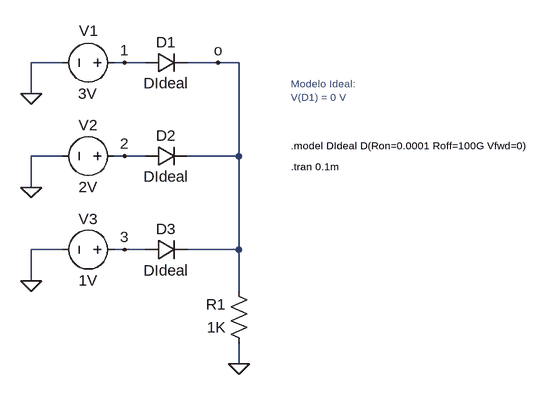
[diagram p0: schematic taller2_ejercicio1e.asc]
taller2_ejercicio1e.asc, the LTspice schematic file:
Version 4
SHEET 1 1376 680
WIRE -208 32 -256 32
WIRE -112 32 -128 32
WIRE -80 32 -112 32
WIRE 32 32 -16 32
WIRE 64 32 32 32
WIRE -256 80 -256 32
WIRE -208 176 -256 176
WIRE -112 176 -128 176
WIRE -80 176 -112 176
WIRE 64 176 64 32
WIRE 64 176 -16 176
WIRE -256 224 -256 176
WIRE -208 320 -256 320
WIRE -112 320 -128 320
WIRE -80 320 -112 320
WIRE 64 320 64 176
WIRE 64 320 -16 320
WIRE -256 368 -256 320
WIRE 64 384 64 320
WIRE 64 496 64 464
FLAG -256 80 0
FLAG -256 224 0
FLAG -256 368 0
FLAG 64 496 0
FLAG 32 32 o
FLAG -112 32 1
FLAG -112 176 2
FLAG -112 320 3
SYMBOL diode -80 48 R270
WINDOW 0 32 32 VTop 2
WINDOW 3 0 32 VBottom 2
SYMATTR InstName D1
SYMATTR Value DIdeal
SYMBOL voltage -112 32 R90
WINDOW 123 0 0 Left 0
WINDOW 39 0 0 Left 0
WINDOW 0 -49 41 VRight 2
WINDOW 3 48 42 VRight 2
SYMATTR InstName V1
SYMATTR Value 3V
SYMBOL res 80 480 R180
WINDOW 0 36 76 Left 2
WINDOW 3 36 40 Left 2
SYMATTR InstName R1
SYMATTR Value 1K
SYMBOL diode -80 192 R270
WINDOW 0 32 32 VTop 2
WINDOW 3 0 32 VBottom 2
SYMATTR InstName D2
SYMATTR Value DIdeal
SYMBOL diode -80 336 R270
WINDOW 0 32 32 VTop 2
WINDOW 3 0 32 VBottom 2
SYMATTR InstName D3
SYMATTR Value DIdeal
SYMBOL voltage -112 176 R90
WINDOW 0 -32 56 VBottom 2
WINDOW 3 32 56 VTop 2
SYMATTR InstName V2
SYMATTR Value 2V
SYMBOL voltage -112 320 R90
WINDOW 0 -32 56 VBottom 2
WINDOW 3 32 56 VTop 2
SYMATTR InstName V3
SYMATTR Value 1V
TEXT 144 192 Left 1 !.tran 0.1m
TEXT 144 160 Left 1 !.model DIdeal D(Ron=0.0001 Roff=100G Vfwd=0)
TEXT 144 64 Left 1 ;Modelo Ideal:\nV(D1) = 0 V

The netlist it stands for:
* taller2_ejercicio1e.asc
D1 1 o DIdeal
V1 1 0 3V
R1 0 o 1K
D2 2 o DIdeal
D3 3 o DIdeal
V2 2 0 2V
V3 3 0 1V
.model D D
.lib standard.dio
.tran 0.1m
.model DIdeal D(Ron=0.0001 Roff=100G Vfwd=0)
* Modelo Ideal:
* V(D1) = 0 V
.backanno
.end